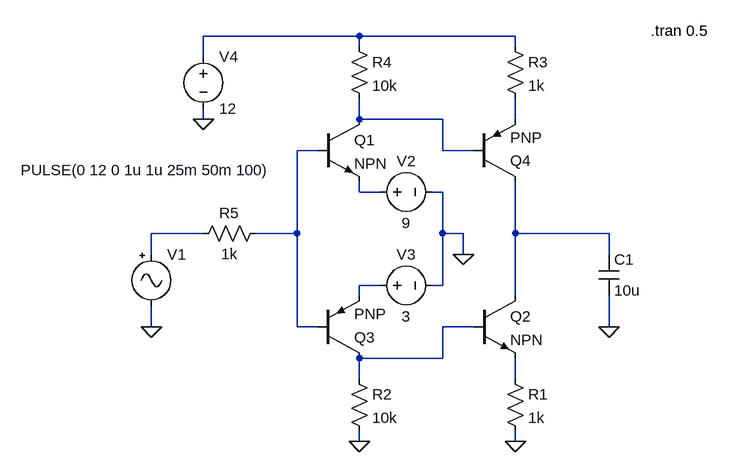
[diagram p0: schematic Draft3.asc]
Draft3.asc, the LTspice schematic file:
Version 4
SHEET 1 944 680
WIRE 400 16 160 16
WIRE 640 16 400 16
WIRE 400 32 400 16
WIRE 640 32 640 16
WIRE 160 48 160 16
WIRE 160 144 160 128
WIRE 400 144 400 112
WIRE 528 144 400 144
WIRE 640 144 640 112
WIRE 336 192 304 192
WIRE 528 192 528 144
WIRE 576 192 528 192
WIRE 400 256 400 240
WIRE 432 256 400 256
WIRE 528 256 512 256
WIRE 160 320 80 320
WIRE 304 320 304 192
WIRE 304 320 240 320
WIRE 528 320 528 256
WIRE 560 320 528 320
WIRE 640 320 640 240
WIRE 784 320 640 320
WIRE 80 352 80 320
WIRE 560 352 560 320
WIRE 784 352 784 320
WIRE 432 400 400 400
WIRE 528 400 528 320
WIRE 528 400 512 400
WIRE 400 416 400 400
WIRE 640 416 640 320
WIRE 80 464 80 432
WIRE 304 464 304 320
WIRE 336 464 304 464
WIRE 576 464 528 464
WIRE 784 464 784 416
WIRE 528 512 528 464
WIRE 528 512 400 512
WIRE 400 544 400 512
WIRE 640 544 640 512
WIRE 400 640 400 624
WIRE 640 640 640 624
FLAG 400 640 0
FLAG 784 464 0
FLAG 640 640 0
FLAG 80 464 0
FLAG 560 352 0
FLAG 160 144 0
SYMBOL npn 336 144 R0
SYMATTR InstName Q1
SYMBOL npn 576 416 R0
SYMATTR InstName Q2
SYMBOL pnp 336 512 M180
SYMATTR InstName Q3
SYMBOL pnp 576 240 M180
SYMATTR InstName Q4
SYMBOL cap 768 352 R0
SYMATTR InstName C1
SYMATTR Value 10u
SYMBOL Res 624 528 R0
SYMATTR InstName R1
SYMATTR Value 1k
SYMBOL Res 384 528 R0
SYMATTR InstName R2
SYMATTR Value 10k
SYMBOL Res 624 16 R0
SYMATTR InstName R3
SYMATTR Value 1k
SYMBOL Res 384 16 R0
SYMATTR InstName R4
SYMATTR Value 10k
SYMBOL Misc/signal 80 336 R0
WINDOW 3 -201 -114 Left 2
SYMATTR InstName V1
SYMATTR Value PULSE(0 12 0 1u 1u 25m 50m 100)
SYMBOL res 256 304 R90
WINDOW 0 0 56 VBottom 2
WINDOW 3 32 56 VTop 2
SYMATTR InstName R5
SYMATTR Value 1k
SYMBOL voltage 416 256 R270
WINDOW 0 32 56 VTop 2
WINDOW 3 -32 56 VBottom 2
SYMATTR InstName V2
SYMATTR Value 9
SYMBOL voltage 416 400 R270
WINDOW 0 32 56 VTop 2
WINDOW 3 -32 56 VBottom 2
SYMATTR InstName V3
SYMATTR Value 3
SYMBOL voltage 160 32 R0
SYMATTR InstName V4
SYMATTR Value 12
TEXT 848 8 Left 2 !.tran 0.5

The netlist it stands for:
* Draft3.asc
Q1 N002 N004 N005 0 NPN
Q2 N007 N009 N010 0 NPN
Q3 N009 N004 N008 0 PNP
Q4 N007 N002 N003 0 PNP
C1 N007 0 10u
R1 N010 0 1k
R2 N009 0 10k
R3 N001 N003 1k
R4 N001 N002 10k
V1 N006 0 PULSE(0 12 0 1u 1u 25m 50m 100)
R5 N004 N006 1k
V2 N005 0 9
V3 N008 0 3
V4 N001 0 12
.model NPN NPN
.model PNP PNP
.lib standard.bjt
.tran 0.5
.backanno
.end